# EasyEDA schematic EasyEDA Schematic - Bipolar Stepper Motor Controller.json
TITLE: Bipolar Stepper Motor Controller V2; REV: 1.0; Date: 2025-09-11; Sheet: 1/1; Drawn By: Jordan Day; Company: Day Controls
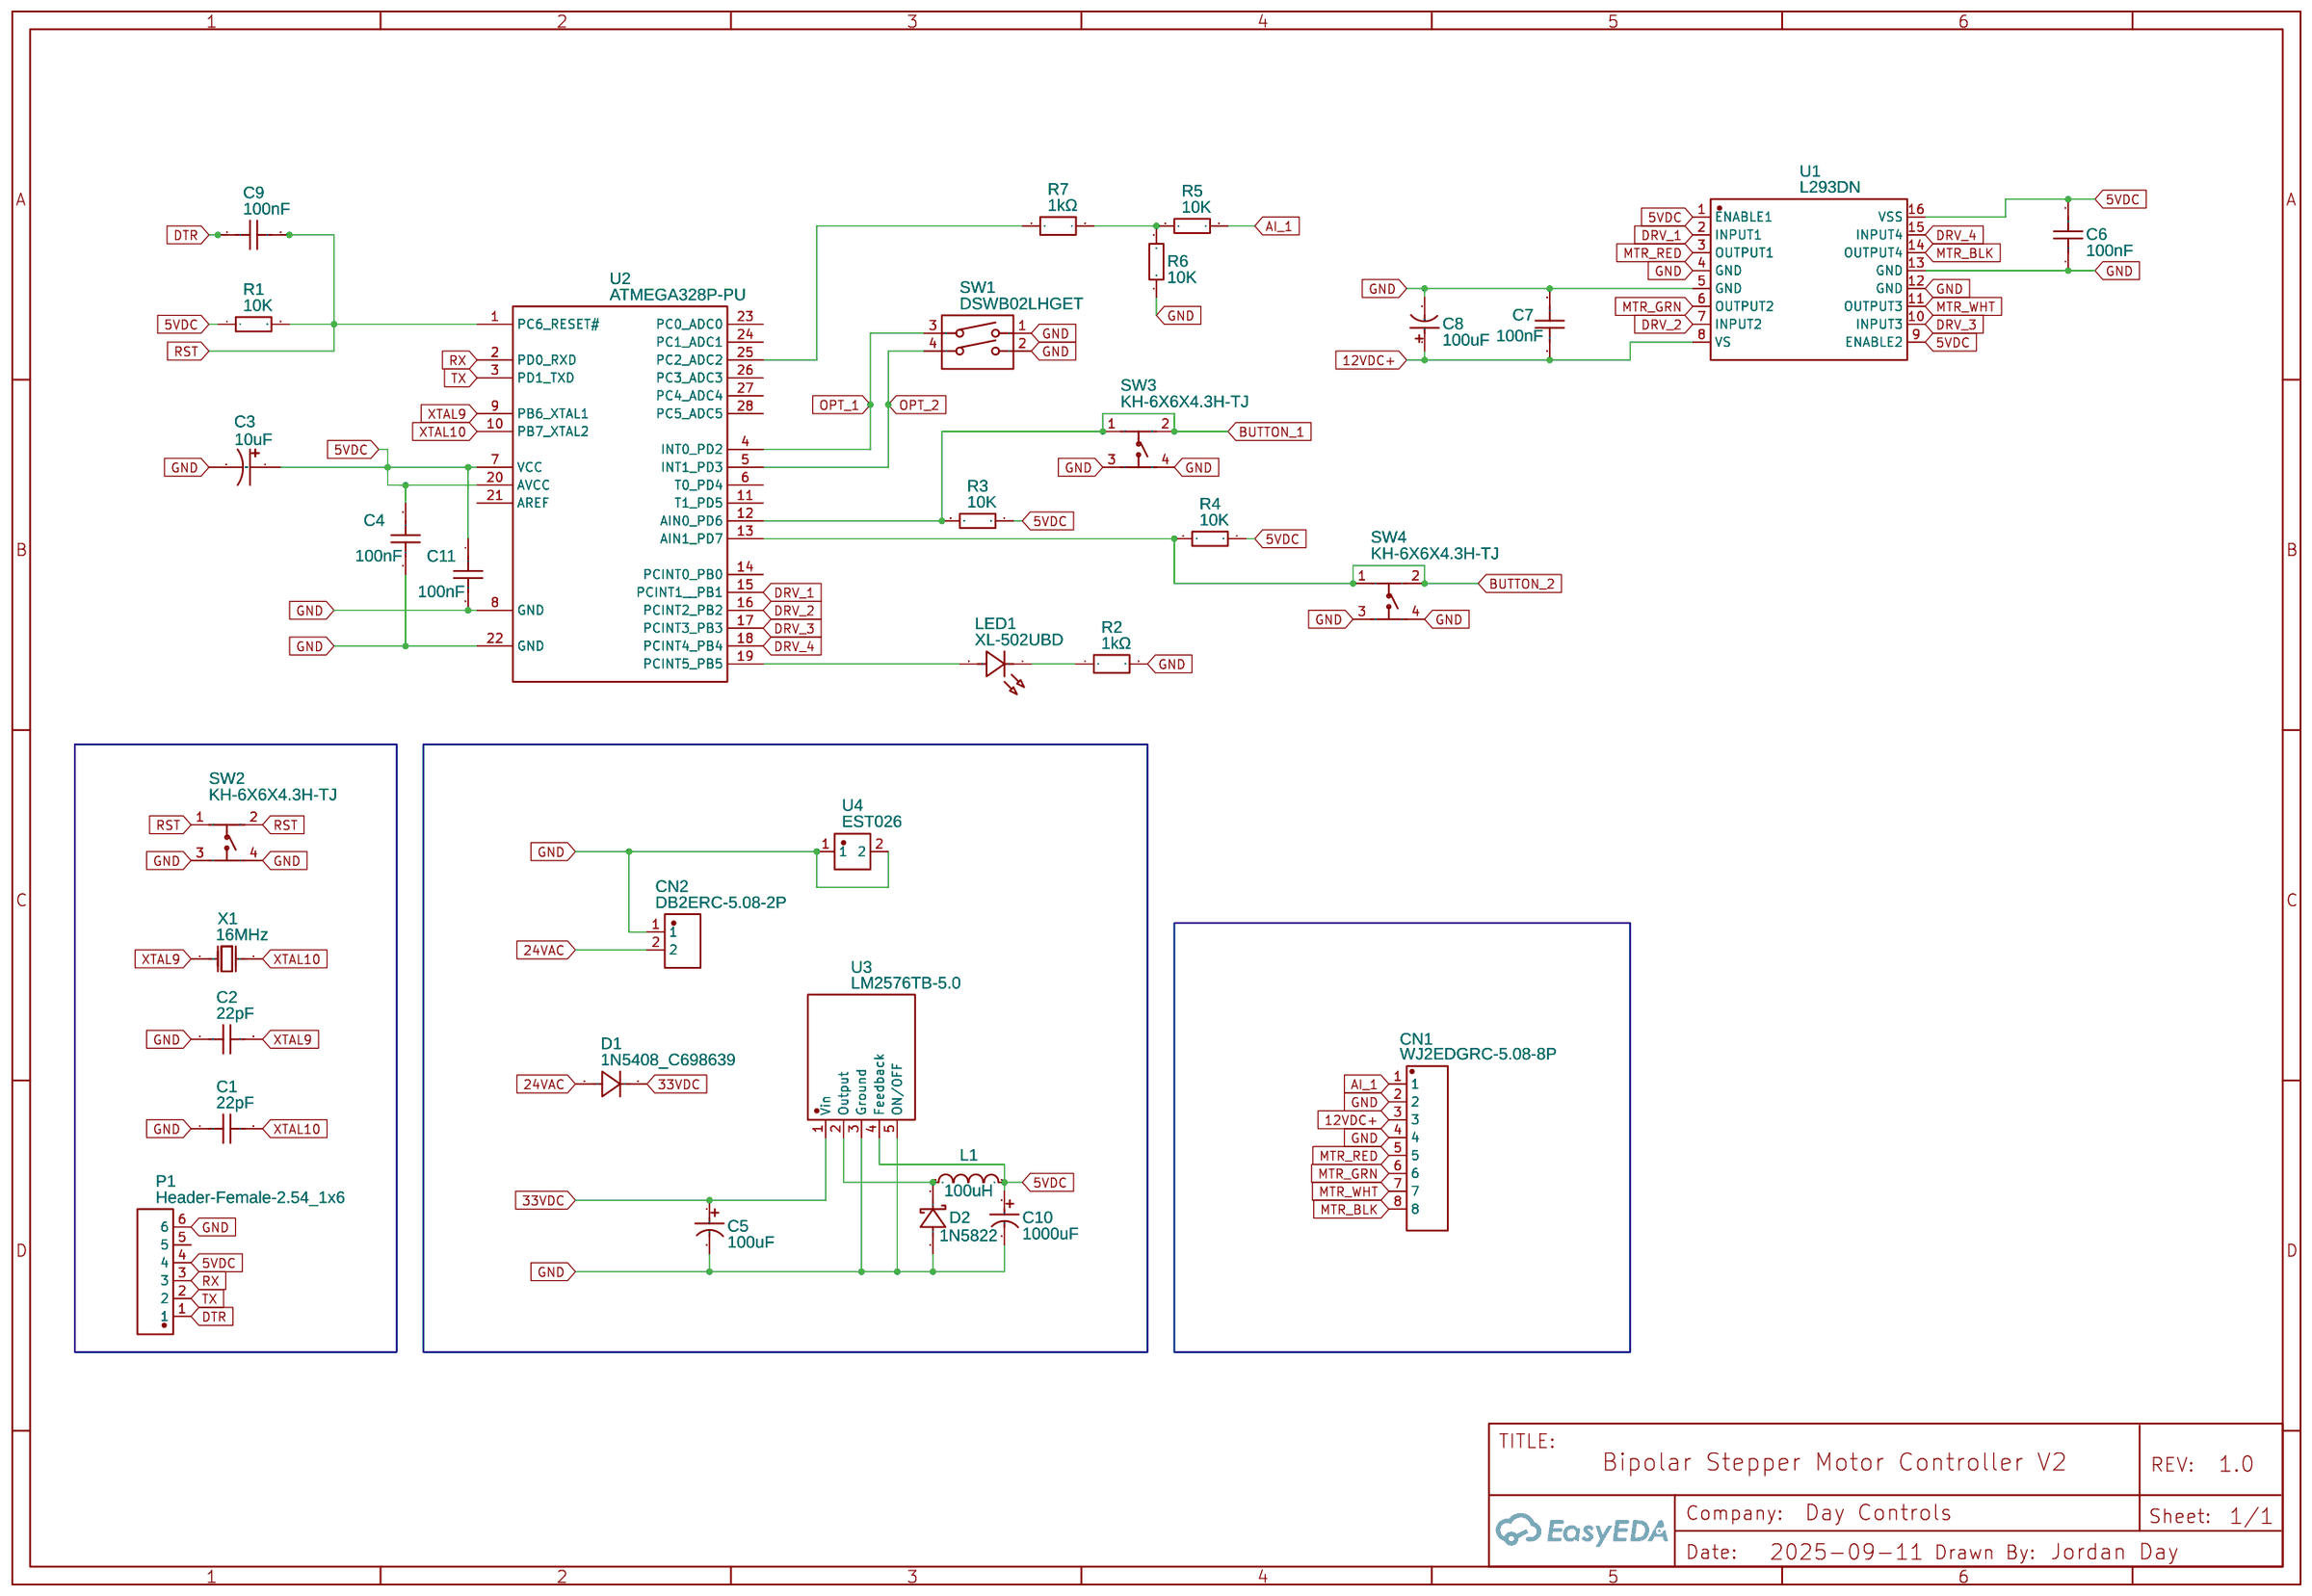
[diagram p0: schematic sheet]

## Parts
C1  22pF  [CAP-TH_L5.5-W4.0-P5.00-D0.5]
C2  22pF  [CAP-TH_L5.5-W4.0-P5.00-D0.5]
C3  10uF  [CAP-TH_BD5.0-P2.00-D0.8-FD]
C4  100nF  [CAP-TH_L5.0-W2.5-P5.00-D1.0]
C5  100uF  [CAP-TH_BD8.0-P3.50-D0.6-FD]
C6  100nF  [CAP-TH_L5.0-W2.5-P5.00-D1.0]
C7  100nF  [CAP-TH_L5.0-W2.5-P5.00-D1.0]
C8  100uF  [CAP-TH_BD8.0-P3.50-D0.6-FD]
C9  100nF  [CAP-TH_L5.0-W2.5-P5.00-D1.0]
C10  1000uF  [CAP-TH_BD13.0-P5.00-D1.2-FD]
C11  100nF  [CAP-TH_L5.0-W2.5-P5.00-D1.0]
CN1  WJ2EDGRC-5.08-8P  [CONN-TH_8P-P5.08_WJ2EDGRC-5.08-8P]
CN2  DB2ERC-5.08-2P  [CONN-TH_2P-P5.08_DB2ERC-5.08-2P]
D1  1N5408_C698639  [DO-201AD_BD5.3-L8.4-P12.50-D1.4-RD]
D2  1N5822  [DO-201AD_BD5.3-L8.4-P12.50-D1.4-FD]
L1  100uH  [IND-TH_BD10.0-P5.00-D0.7]
LED1  XL-502UBD  [LED-TH_BD5.9-P2.54-RD_BLUE]
P1  Header-Female-2.54_1x6  [HDR-TH_6P-P2.54-V-F]
R1  10K  [RES-TH_BD2.2-L6.5-P10.50-D0.6]
R2  1kΩ  [RES-TH_BD2.3-L6.5-P10.50-D0.5]
R3  10K  [RES-TH_BD2.2-L6.5-P10.50-D0.6]
R4  10K  [RES-TH_BD2.2-L6.5-P10.50-D0.6]
R5  10K  [RES-TH_BD2.2-L6.5-P10.50-D0.6]
R6  10K  [RES-TH_BD2.2-L6.5-P10.50-D0.6]
R7  1kΩ  [RES-TH_BD2.3-L6.5-P10.50-D0.5]
SW1  DSWB02LHGET  [SW-TH_DSWB02LHGET]
SW2  KH-6X6X4.3H-TJ  [SW-TH_4P-L6.0-W6.0-P4.50-LS6.5]
SW3  KH-6X6X4.3H-TJ  [SW-TH_4P-L6.0-W6.0-P4.50-LS6.5]
SW4  KH-6X6X4.3H-TJ  [SW-TH_4P-L6.0-W6.0-P4.50-LS6.5]
U1  L293DN  [DIP-16_L19.2-W6.6-P2.54-LS7.6-BL]
U2  ATMEGA328P-PU  [DIP-28_L34.6-W7.3-P2.54-LS10.2-BL]
U3  LM2576TB-5.0  [TO-220-5_L10.2-W4.8-P1.70-TL]
U4  EST026  [CONN-TH_L6.3-W0.8-EST026]
X1  16MHz  [OSC-TH_L10.0-W4.5-P5.00]

## Library data of the parts
C1 C2 = DCH220K22YR N6FH5GD: Supplier: LCSC; Supplier Part: C2896329; Manufacturer: SHM(南方宏明); link: https://atta.szlcsc.com/upload/public/pdf/source/20210929/D12BDEFD6E4AEAF516C103DFCB28E4F2.pdf; Contributor: lcsc
C3 = ECR1HPT100MLL050011: Supplier: LCSC; Supplier Part: C190963; Manufacturer: Nantong Jianghai Capacitor; Contributor: LCSC; JLCPCB Part Class: Extended Part
C4 C6 C7 C9 C11 = CC1H104MC1FD3F6C10MF: Supplier: LCSC; Supplier Part: C254085; Manufacturer: Dersonic(德尔创); Contributor: LCSC; JLCPCB Part Class: Extended Part
C5 C8 = 100uF 50V 8*12Black high frequency: Supplier: LCSC; Manufacturer: CX(承兴); Manufacturer Part: GR107M050F12RR0VH4FP0; Supplier Part: C45102; JLCPCB Part Class: Extended Part
C10 = 35YXJ1000M12.5X20: Supplier: LCSC; Manufacturer: rubycon(红宝石); Supplier Part: C88743; JLCPCB Part Class: Extended Part
CN1 = WJ2EDGRC-5.08-8P: Supplier: LCSC; Supplier Part: C27587; JLCPCB Part Class: Extended Part; Manufacturer: KANGNEX(康奈克斯电气)
CN2 = DB2ERC-5.08-2P: Supplier: LCSC; Supplier Part: C395737; Manufacturer: DIBO(地博电气); Manufacturer Part: DB2ERC-5.08-2P-GN; Contributor: LCSC; JLCPCB Part Class: Extended Part
D1 = 1N5408_C698639: Supplier: LCSC; Supplier Part: C698639; Manufacturer: YANGJIE(扬杰); Manufacturer Part: 1N5408; Contributor: LCSC; JLCPCB Part Class: Extended Part
D2 = 1N5822_C3018526: Supplier: LCSC; Supplier Part: C3018526; Manufacturer: FUXINSEMI(富芯森美); Contributor: lcsc; JLCPCB Part Class: Extended Part
L1 = VLU0810-101K: Supplier: LCSC; Manufacturer: FH(风华); Supplier Part: C72630; JLCPCB Part Class: Extended Part
LED1 = XL-502UBD: Supplier: LCSC; Supplier Part: C2895496; Manufacturer: XINGLIGHT(成兴光); JLCPCB Part Class: Extended Part; Contributor: lcsc
P1 = Header-Female-2.54_1x6: Supplier: LCSC; Manufacturer: BOOMELE(博穆精密); Manufacturer Part: 2.54-1*6P母; Supplier Part: C40877; JLCPCB Part Class: Extended Part
R1 R3-R6 = MFR50SFTE52-10K: Supplier: LCSC; Supplier Part: C173139; Manufacturer: YAGEO(国巨); Contributor: LCSC; JLCPCB Part Class: Extended Part; Resistance: 10kΩ
R2 R7 = MF1/4W-1KΩ±1%T52: Supplier: LCSC; Supplier Part: C713997; Manufacturer: Huaxing Mechanical-Elec.; Contributor: LCSC; JLCPCB Part Class: Extended Part
SW1 = DSWB02LHGET: Contributor: LCSC; Supplier: LCSC; Supplier Part: C99421; Manufacturer: YE; JLCPCB Part Class: Extended Part
SW2-SW4 = KH-6X6X4.3H-TJ: Supplier: LCSC; Supplier Part: C2837514; Manufacturer: kinghelm(金航标); Contributor: LCSC; JLCPCB Part Class: Extended Part
U1 = L293DN: Contributor: LCSC; Supplier: LCSC; Supplier Part: C434590; Manufacturer: HGSEMI(华冠); JLCPCB Part Class: Extended Part
U2 = ATMEGA328P-PU: sourceId: Oic6oiASL; Supplier: LCSC; Manufacturer: MICROCHIP(美国微芯); Contributor: LCSC; Supplier Part: C33901; JLCPCB Part Class: Extended Part
U3 = LM2576TB-5.0: Supplier: LCSC; Supplier Part: C5160073; Manufacturer: HGSEMI(华冠); link: https://atta.szlcsc.com/upload/public/pdf/source/20220920/BAE03355F1D658EA05EE543F8BD8FFC3.pdf; Contributor: lcsc
U4 = EST026: Supplier: LCSC; Supplier Part: C52878; Manufacturer: xcfuse(旭程); JLCPCB Part Class: Extended Part; Contributor: LCSC
X1 = X49SD16MSD2SC: Supplier: LCSC; Manufacturer: YXC(扬兴晶振); Supplier Part: C16212; JLCPCB Part Class: Extended Part

## Nets
5VDC: C3.1 C4.1 C6.2 C10.1 C11.1 L1.2 P1.4 R1.1 R3.1 R4.1 U1.1(ENABLE1) U1.9(ENABLE2) U1.16(VSS) U2.7(VCC) U2.20(AVCC) U3.4(Feedback)
12VDC+: C7.1 C8.1 CN1.3 U1.8(VS)
24VAC: CN2.2 D1.2(A)
33VDC: C5.1 D1.1(K) U3.1(Vin)
GND: C1.1 C2.1 C3.2 C4.2 C5.2 C6.1 C7.2 C8.2 C10.2 C11.2 CN1.2 CN1.4 CN2.1 D2.1(A) P1.6 R2.2 R6.2 SW1.1 SW1.2 SW2.3 SW2.4 SW3.3 SW3.4 SW4.3 SW4.4 U1.4(GND) U1.5(GND) U1.12(GND) U1.13(GND) U2.8(GND) U2.22(GND) U3.3(Ground) U3.5(ON/OFF) U4.1 U4.2
AI_1: CN1.1 R5.1
BUTTON_1: R3.2 SW3.1 SW3.2 U2.12(AIN0 PD6)
BUTTON_2: R4.2 SW4.1 SW4.2 U2.13(AIN1 PD7)
DRV_1: U1.2(INPUT1) U2.15(PCINT1  PB1)
DRV_2: U1.7(INPUT2) U2.16(PCINT2 PB2)
DRV_3: U1.10(INPUT3) U2.17(PCINT3 PB3)
DRV_4: U1.15(INPUT4) U2.18(PCINT4 PB4)
DTR: C9.1 P1.1
MTR_BLK: CN1.8 U1.14(OUTPUT4)
MTR_GRN: CN1.6 U1.6(OUTPUT2)
MTR_RED: CN1.5 U1.3(OUTPUT1)
MTR_WHT: CN1.7 U1.11(OUTPUT3)
OPT_1: SW1.3 U2.4(INT0 PD2)
OPT_2: SW1.4 U2.5(INT1 PD3)
RST: C9.2 R1.2 SW2.1 SW2.2 U2.1(PC6 RESET#)
RX: P1.3 U2.2(PD0 RXD)
TX: P1.2 U2.3(PD1 TXD)
XTAL9: C2.2 U2.9(PB6 XTAL1) X1.2(OSC2)
XTAL10: C1.2 U2.10(PB7 XTAL2) X1.1(OSC1)
Net-(D2-2): D2.2(K) L1.1 U3.2(Output)
Net-(LED1-1): LED1.1(K) R2.1
Net-(LED1-2): LED1.2(A) U2.19(PCINT5 PB5)
Net-(R5-2): R5.2 R6.1 R7.2
Net-(R7-1): R7.1 U2.25(PC2 ADC2)

Not connected (* = marked no-connect by the designer): P1 5; U2 6(T0 PD4) 11(T1 PD5) 14(PCINT0 PB0) 21(AREF) 23(PC0 ADC0) 24(PC1 ADC1) 26(PC3 ADC3) 27(PC4 ADC4) 28(PC5 ADC5)
